# Altium schematic sheet STM32F407.SchDoc
size A4; DocumentNumber: 10; SheetNumber: 10; SheetTotal: 12
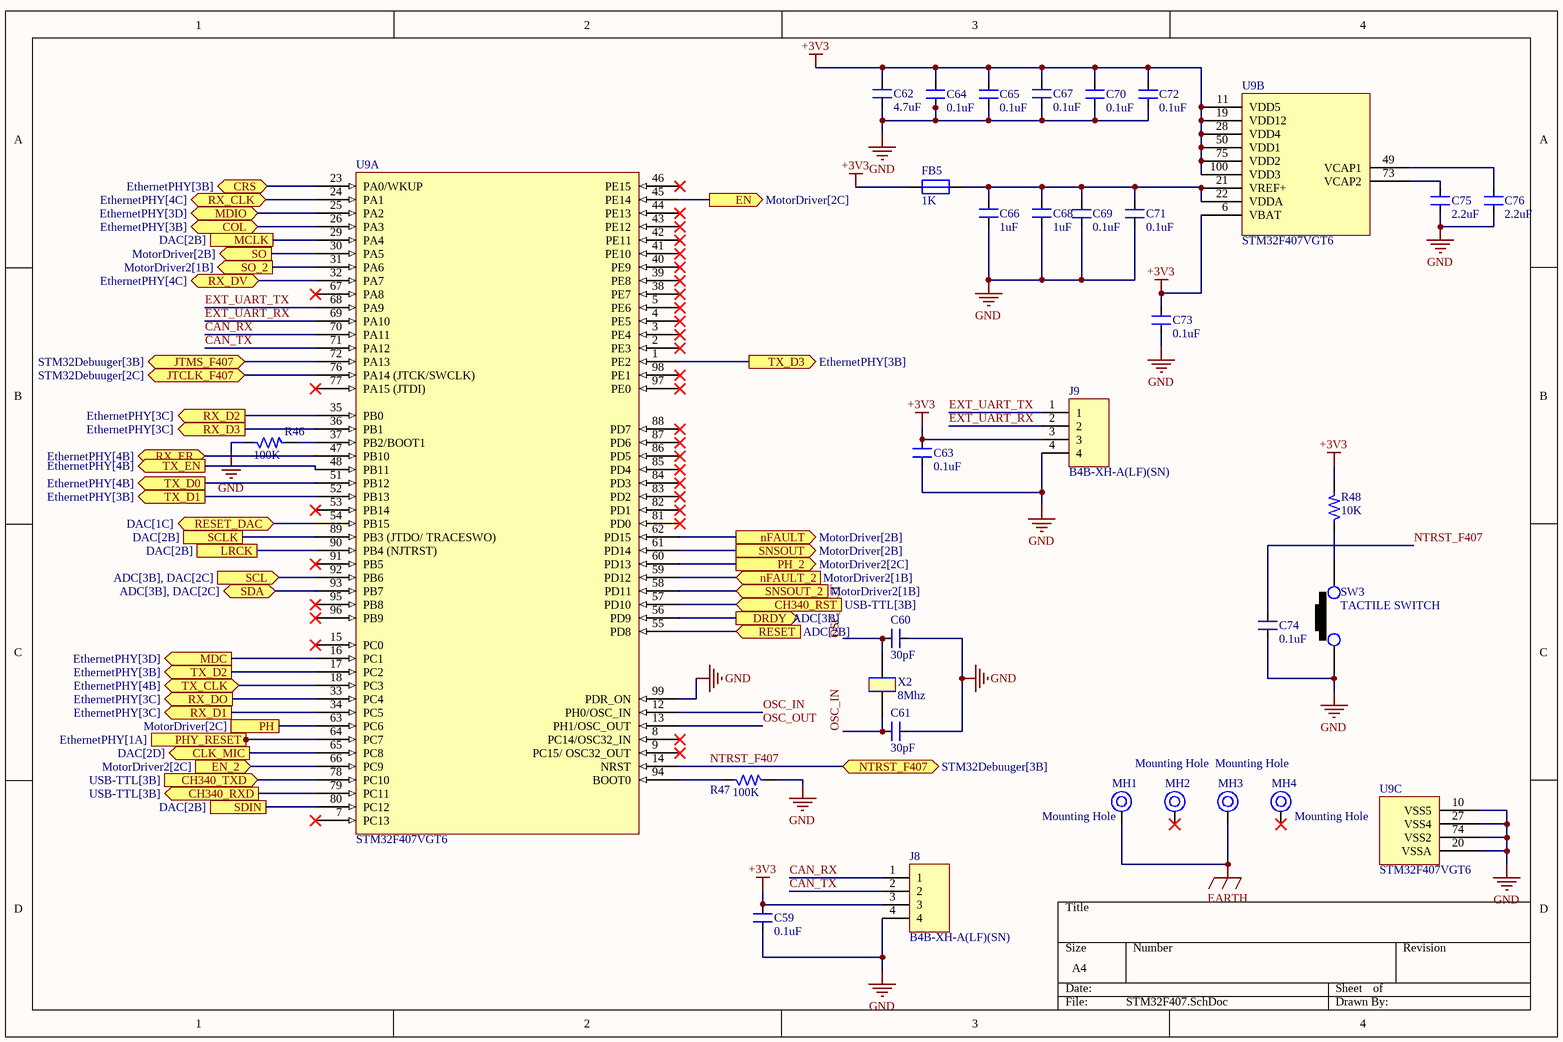
[diagram p0: STM32F407.SchDoc]

## Parts
C59  0.1uF  [CAP_0805]
C60  30pF  [CAP_0805]
C61  30pF  [CAP_0805]
C62  4.7uF  [CAP_0805]
C63  0.1uF  [CAP_0805]
C64  0.1uF  [CAP_0805]
C65  0.1uF  [CAP_0805]
C66  1uF  [CAP_0805]
C67  0.1uF  [CAP_0805]
C68  1uF  [CAP_0805]
C69  0.1uF  [CAP_0805]
C70  0.1uF  [CAP_0805]
C71  0.1uF  [CAP_0805]
C72  0.1uF  [CAP_0805]
C73  0.1uF  [CAP_0805]
C74  0.1uF  [CAP_0805]
C75  2.2uF  [CAP_0805]
C76  2.2uF  [CAP_0805]
FB5  1K  [IND_0805]
J8  B4B-XH-A(LF)(SN)  [CON4_100_B4B-XH-A_TH_ST]
J9  B4B-XH-A(LF)(SN)  [CON4_100_B4B-XH-A_TH_ST]
MH1  Mounting Hole  [MOUNTING]
MH2  Mounting Hole  [MOUNTING]
MH3  Mounting Hole  [MOUNTING]
MH4  Mounting Hole  [MOUNTING]
R46  100K  [RES_0603]
R47  100K  [RES_0603]
R48  10K  [RES_0603]
SW3  TACTILE SWITCH  [SW_342_SMD]
U9  STM32F407VGT6  [QFN100_19.6_669_58X10_SMD]  (parts A,B,C of 3)
X2  8Mhz  [XTAL_314_240X47_SMD]

## Ports
CH340_RST (in, see USB-TTL[3B]), CH340_RXD (out, see USB-TTL[3B]), CH340_TXD (in, see USB-TTL[3B]), CLK_MIC (out, see DAC[2D]), COL (bidir, see EthernetPHY[3B]), CRS (bidir, see EthernetPHY[3B]), DRDY (out, see ADC[3B]), EN (out, see MotorDriver[2C]), EN_2 (in, see MotorDriver2[2C]), JTCLK_F407 (bidir, see STM32Debuuger[2C]), JTMS_F407 (bidir, see STM32Debuuger[3B]), LRCK (see DAC[2B]), MCLK (see DAC[2B]), MDC (out, see EthernetPHY[3D]), MDIO (bidir, see EthernetPHY[3D]), nFAULT (out, see MotorDriver[2B]), nFAULT_2 (in, see MotorDriver2[1B]), NTRST_F407 (bidir, see STM32Debuuger[3B]), PH (see MotorDriver[2C]), PH_2 (out, see MotorDriver2[2C]), PHY_RESET (in, see EthernetPHY[1A]), RESET (in, see ADC[2B]), RESET_DAC (bidir, see DAC[1C]), RX_CLK (bidir, see EthernetPHY[4C]), RX_D1 (out, see EthernetPHY[3C]), RX_D2 (out, see EthernetPHY[3C]), RX_D3 (out, see EthernetPHY[3C]), RX_DO (out, see EthernetPHY[3C]), RX_DV (bidir, see EthernetPHY[4C]), RX_ER (bidir, see EthernetPHY[4B]), SCL (in, see ADC[3B], DAC[2C]), SCLK (see DAC[2B]), SDA (bidir, see ADC[3B], DAC[2C]), SDIN (see DAC[2B]), SNSOUT (out, see MotorDriver[2B]), SNSOUT_2 (in, see MotorDriver2[1B]), SO (out, see MotorDriver[2B]), SO_2 (out, see MotorDriver2[1B]), TX_CLK (bidir, see EthernetPHY[4B]), TX_D0 (out, see EthernetPHY[4B]), TX_D1 (out, see EthernetPHY[3B]), TX_D2 (out, see EthernetPHY[3B]), TX_D3 (out, see EthernetPHY[3B]), TX_EN (out, see EthernetPHY[4B])

## Nets
+3V3: C59.2 C62.2 C63.2 C64.2 C65.2 C67.2 C70.2 C72.2 C73.2 FB5.1 J8.3 J9.3 R48.2 U9.6(VBAT) U9.11(VDD5) U9.19(VDD12) U9.28(VDD4) U9.50(VDD1) U9.75(VDD2) U9.100(VDD3)
EARTH: MH1.1 MH3.1
GND: C59.1 C60.2 C61.2 C62.1 C63.1 C64.1 C65.1 C66.1 C67.1 C68.1 C69.1 C70.1 C71.1 C72.1 C73.1 C74.1 C75.1 C76.1 J8.4 J9.4 R46.1 R47.2 SW3.1 U9.10(VSS5) U9.20(VSSA) U9.27(VSS4) U9.74(VSS2) U9.99(PDR_ON)
CAN_RX: J8.1 U9.70(PA11)
CAN_TX: J8.2 U9.71(PA12)
CH340_RST: U9.57(PD10) ; port CH340_RST
CH340_RXD: U9.79(PC11) ; port CH340_RXD
CH340_TXD: U9.78(PC10) ; port CH340_TXD
CLK_MIC: U9.65(PC8) ; port CLK_MIC
COL: U9.26(PA3) ; port COL
CRS: U9.23(PA0/WKUP) ; port CRS
DRDY: U9.56(PD9) ; port DRDY
EN: U9.45(PE14) ; port EN
EN_2: U9.66(PC9) ; port EN_2
EXT_UART_RX: J9.2 U9.69(PA10)
EXT_UART_TX: J9.1 U9.68(PA9)
JTCLK_F407: U9.76(PA14_(JTCK/SWCLK)) ; port JTCLK_F407
JTMS_F407: U9.72(PA13) ; port JTMS_F407
LRCK: U9.90(PB4_(NJTRST)) ; port LRCK
MCLK: U9.29(PA4) ; port MCLK
MDC: U9.16(PC1) ; port MDC
MDIO: U9.25(PA2) ; port MDIO
nFAULT: U9.62(PD15) ; port nFAULT
nFAULT_2: U9.59(PD12) ; port nFAULT_2
NTRST_F407: C74.2 U9.14(NRST) ; port NTRST_F407
OSC_IN: C61.1 U9.12(PH0/OSC_IN) X2.1
OSC_OUT: C60.1 U9.13(PH1/OSC_OUT) X2.2
PH: U9.63(PC6) ; port PH
PH_2: U9.60(PD13) ; port PH_2
PHY_RESET: U9.64(PC7) ; port PHY_RESET
RESET: U9.55(PD8) ; port RESET
RESET_DAC: U9.54(PB15) ; port RESET_DAC
RX_CLK: U9.24(PA1) ; port RX_CLK
RX_D1: U9.34(PC5) ; port RX_D1
RX_D2: U9.35(PB0) ; port RX_D2
RX_D3: U9.36(PB1) ; port RX_D3
RX_DO: U9.33(PC4) ; port RX_DO
RX_DV: U9.32(PA7) ; port RX_DV
RX_ER: U9.47(PB10) ; port RX_ER
SCL: U9.92(PB6) ; port SCL
SCLK: U9.89(PB3_(JTDO/_TRACESWO)) ; port SCLK
SDA: U9.93(PB7) ; port SDA
SDIN: U9.80(PC12) ; port SDIN
SNSOUT: U9.61(PD14) ; port SNSOUT
SNSOUT_2: U9.58(PD11) ; port SNSOUT_2
SO: U9.30(PA5) ; port SO
SO_2: U9.31(PA6) ; port SO_2
TX_CLK: U9.18(PC3) ; port TX_CLK
TX_D0: U9.51(PB12) ; port TX_D0
TX_D1: U9.52(PB13) ; port TX_D1
TX_D2: U9.17(PC2) ; port TX_D2
TX_D3: U9.1(PE2) ; port TX_D3
TX_EN: U9.48(PB11) ; port TX_EN
NetC66_2: C66.2 C68.2 C69.2 C71.2 FB5.2 U9.21(VREF+) U9.22(VDDA)
NetC75_2: C75.2 U9.73(VCAP2)
NetC76_2: C76.2 U9.49(VCAP1)
NetR46_2: R46.2 U9.37(PB2/BOOT1)
NetR47_1: R47.1 U9.94(BOOT0)
NetR48_1: R48.1 SW3.2

Not connected (* = marked no-connect by the designer): MH2 1*; MH4 1*; U9 2(PE3)* 3(PE4)* 4(PE5)* 5(PE6)* 7(PC13)* 8(PC14/OSC32_IN)* 9(PC15/_OSC32_OUT)* 15(PC0)* 38(PE7)* 39(PE8)* 40(PE9)* 41(PE10)* 42(PE11)* 43(PE12)* 44(PE13)* 46(PE15)* 53(PB14)* 67(PA8)* 77(PA15_(JTDI))* 81(PD0)* 82(PD1)* 83(PD2)* 84(PD3)* 85(PD4)* 86(PD5)* 87(PD6)* 88(PD7)* 91(PB5)* 95(PB8)* 96(PB9)* 97(PE0)* 98(PE1)*

## Library data of the parts
C59 C63-C65 C67 C69-C74 = CAP_0.1uF-50V-10%-0805: 0.1µF ±10% 50V Ceramic Capacitor X7R 0805 (2012 Metric); Manufacturer: Samsung; Manufacturer Part Number: CL21B104KBCNNNC; Alternate Part Number-1: NA; Case/Package: 0805; Supplier-1: SIRICOM; Supplier Part Number-1: 0805B104K500CT
C60 C61 = CAP_30pF-50V-10%-0805: ±10% 50V Ceramic Capacitor C0G, NP0 0805 (2012 Metric); Manufacturer Part Number: C0805C300K5GAC7800; Manufacturer: KEMET; Alternate Part Number: NA; Case/Package: 0805; Supplier-1: Digikey; Supplier Part Number-1: 399-17443-1-ND - Cut Tape (CT)
C62 = CAP_4.7uF-50V-10%-0805: 4.7µF ±10% 50V Ceramic Capacitor X5R 0805 (2012 Metric); Manufacturer: Yageo; Manufacturer Part Number: GRM21BR61H475KE51L; Alternate Part Number-1: NA; Case/Package: 0805; Supplier-1: SIRICOM; Supplier Part Number-1: CL21A475KBQNNNE
C66 C68 = CAP_1uF-50V-5%-0805: 1µF ±5% 50V Ceramic Capacitor X7R 0805 (2012 Metric); Manufacturer: Samsung; Manufacturer Part Number: CC0805JKX7R9BB105; Alternate Part Number-1: 0805F105M500NT; Case/Package: 0805; Supplier-1: SIRICOM; Supplier Part Number-1: CL21B105KBFNNNE
C75 C76 = CAP_2.2uF-25V-10%-0805: 2.2µF ±10% 25V Ceramic Capacitor X7R 0805 (2012 Metric); Manufacturer: KEMET; Manufacturer Part Number: CL21B225KAFNFNE; Alternate Part Number-1: NA; Case/Package: 0805; Supplier-1: SIRICOM; Supplier Part Number-1: CL21A225KAFNNNE
FB5 = FB_1K-100MHZ-1.6A-0805: 1 kOhms @ 100MHz 1 Power Line Ferrite Bead 0805 (2012 Metric) 1.6A; Manufacturer: Laird; Manufacturer Part Number: BLM21SP102SH1D; Alternate Part Number-1: NA; Case/Package: 0805; Supplier-1: SIRICOM; Supplier Part Number-1: ACMS201209A102
J8 J9 = CON-PLG_4X1-100-ST-TH: 4 Pins, 1 Row 2.54mm Pitch, straight Connector, male; Manufacturer: Wurth Electronics; Mating Part Number: XHP-4; Crimp Part Number: ASXHSXH22K51; Alternate Part Number-1: NA; Manufacturer Part Number: B4B-XH-A(LF)(SN); Case/Package: TH-CON; Supplier-1: LCSC; Supplier Part Number-1: B4B-XH-A(LF)(SN)
MH1-MH4 = MH_3.5H_6D: Manufacturer Part Number: NA; Case/Package: TH; Manufacturer: NA; Supplier-1: NA; Supplier Part Number-1: NA; Alternate Part Number-1: NA
R46 R47 = RES_100K-0.1W-1%-0603: 100 kOhms ±1% 0.1W, 1/10W Chip Resistor 0603 (1608 Metric) Automotive AEC-Q200 Thick Film; Manufacturer: Stackpole Electronics; Manufacturer Part Number: RMCF0603FT100K; Alternate Part Number-1: NA; Case/Package: 0603; Supplier-1: Arrow; Supplier Part Number-1: RMCF0603FT100K
R48 = RES_10K-0.1W-1%-0603: 10 kOhms ±1% 0.1W, 1/10W Chip Resistor 0603 (1608 Metric) Automotive AEC-Q200 Thick Film; Manufacturer: Walsin; Manufacturer Part Number: WR06X1002FTL; Alternate Part Number-1: 0603WAJ0103T5E; Case/Package: 0603; Supplier-1: SIRICOM; Supplier Part Number-1: WR06X1002FTL
SW3 = SW1_RS-282G05A3-SMRT-SMD: Tactile Switch SPST-NO Top Actuated Surface Mount; Manufacturer: ITT C&K; Alternate Part Number-1: NA; Manufacturer Part Number: RS-282G05A3-SMRT; Case/Package: SMD; Supplier-1: SP ROAD; Supplier Part Number-1: RS-282G05A3-SMRT
U9 = IC_STM32F407VGT6: ARM® Cortex®-M4 STM32F4 Microcontroller IC 32-Bit 168MHz 1MB (1M x 8) FLASH 100-LQFP (14x14); Manufacturer: STMicroelectronics; Alternate Part Number-1: STM32F407VET6; Manufacturer Part Number: STM32F407VGT6; Case/Package: LQFP100; Supplier-1: ARROW; Supplier Part Number-1: STM32F407VGT6
X2 = XTAL_8MHZ-ECS-80-32-5PX-SMD: 8MHz ±30ppm Crystal 32pF 60 Ohms HC-49/US; Manufacturer: Fox Electronics; Manufacturer Part Number: ECS-80-32-5PX-TR; Alternate Part Number-1: NA; Case/Package: SMD/SMT; Supplier-1: SP ROAD; Supplier Part Number-1: ECS-80-32-5PX-TR